# Altium project RBP-Power.PrjPcb
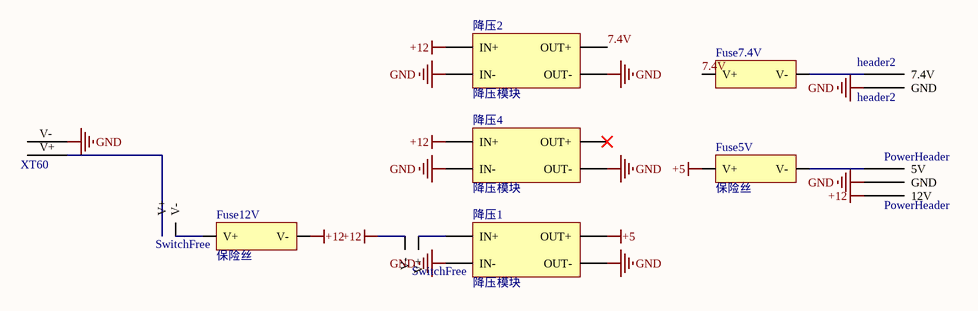
[diagram p0: Sheet2.SchDoc]
1 sheet, 11 parts. Net scope: global (net labels, ports and power ports of the same name join across sheets).
Board files: PCB1.PcbDoc, PCB2.PcbDoc

## Sheet Sheet2.SchDoc
size A4

### Parts
*  SwitchFree  [SwitchFree]
Fuse5V  保险丝  [FUSE]
Fuse7.4V  (no value)  [FUSE]
Fuse12V  保险丝  [FUSE]
header2  header2  [HEADER2]
PowerHeader  PowerHeader  [PowerHeader]
Switch  SwitchFree  [SwitchFree]
XT60  XT60  [XT60]
降压1  降压模块  [贴片1]
降压2  降压模块  [XL4015]
降压4  降压模块  [贴片4-USB]

### Nets
+5: Fuse5V.V+ 降压1.OUT+
+12: *.V- Fuse12V.V- PowerHeader.12V 降压2.IN+ 降压4.IN+
GND: header2.GND PowerHeader.GND XT60.V- 降压1.IN- 降压1.OUT- 降压2.IN- 降压2.OUT- 降压4.IN- 降压4.OUT-
7.4V: Fuse7.4V.V+ 降压2.OUT+
Net*_V+: *.V+ 降压1.IN+
NetFuse5V_V-: Fuse5V.V- PowerHeader.5V
NetFuse7.4V_V-: Fuse7.4V.V- header2.7.4V
NetFuse12V_V+: Fuse12V.V+ Switch.V-
NetSwitch_V+: Switch.V+ XT60.V+

Not connected (* = marked no-connect by the designer): 降压4 OUT+*

### Library data of the parts
Fuse5V Fuse12V = Fuse
Fuse7.4V = Fuse: 保险丝
降压1 = 降压_1
降压2 = 降压2: XL4015
降压4 = 降压_4